# EAGLE design motordriver (EAGLE 7.2.0)
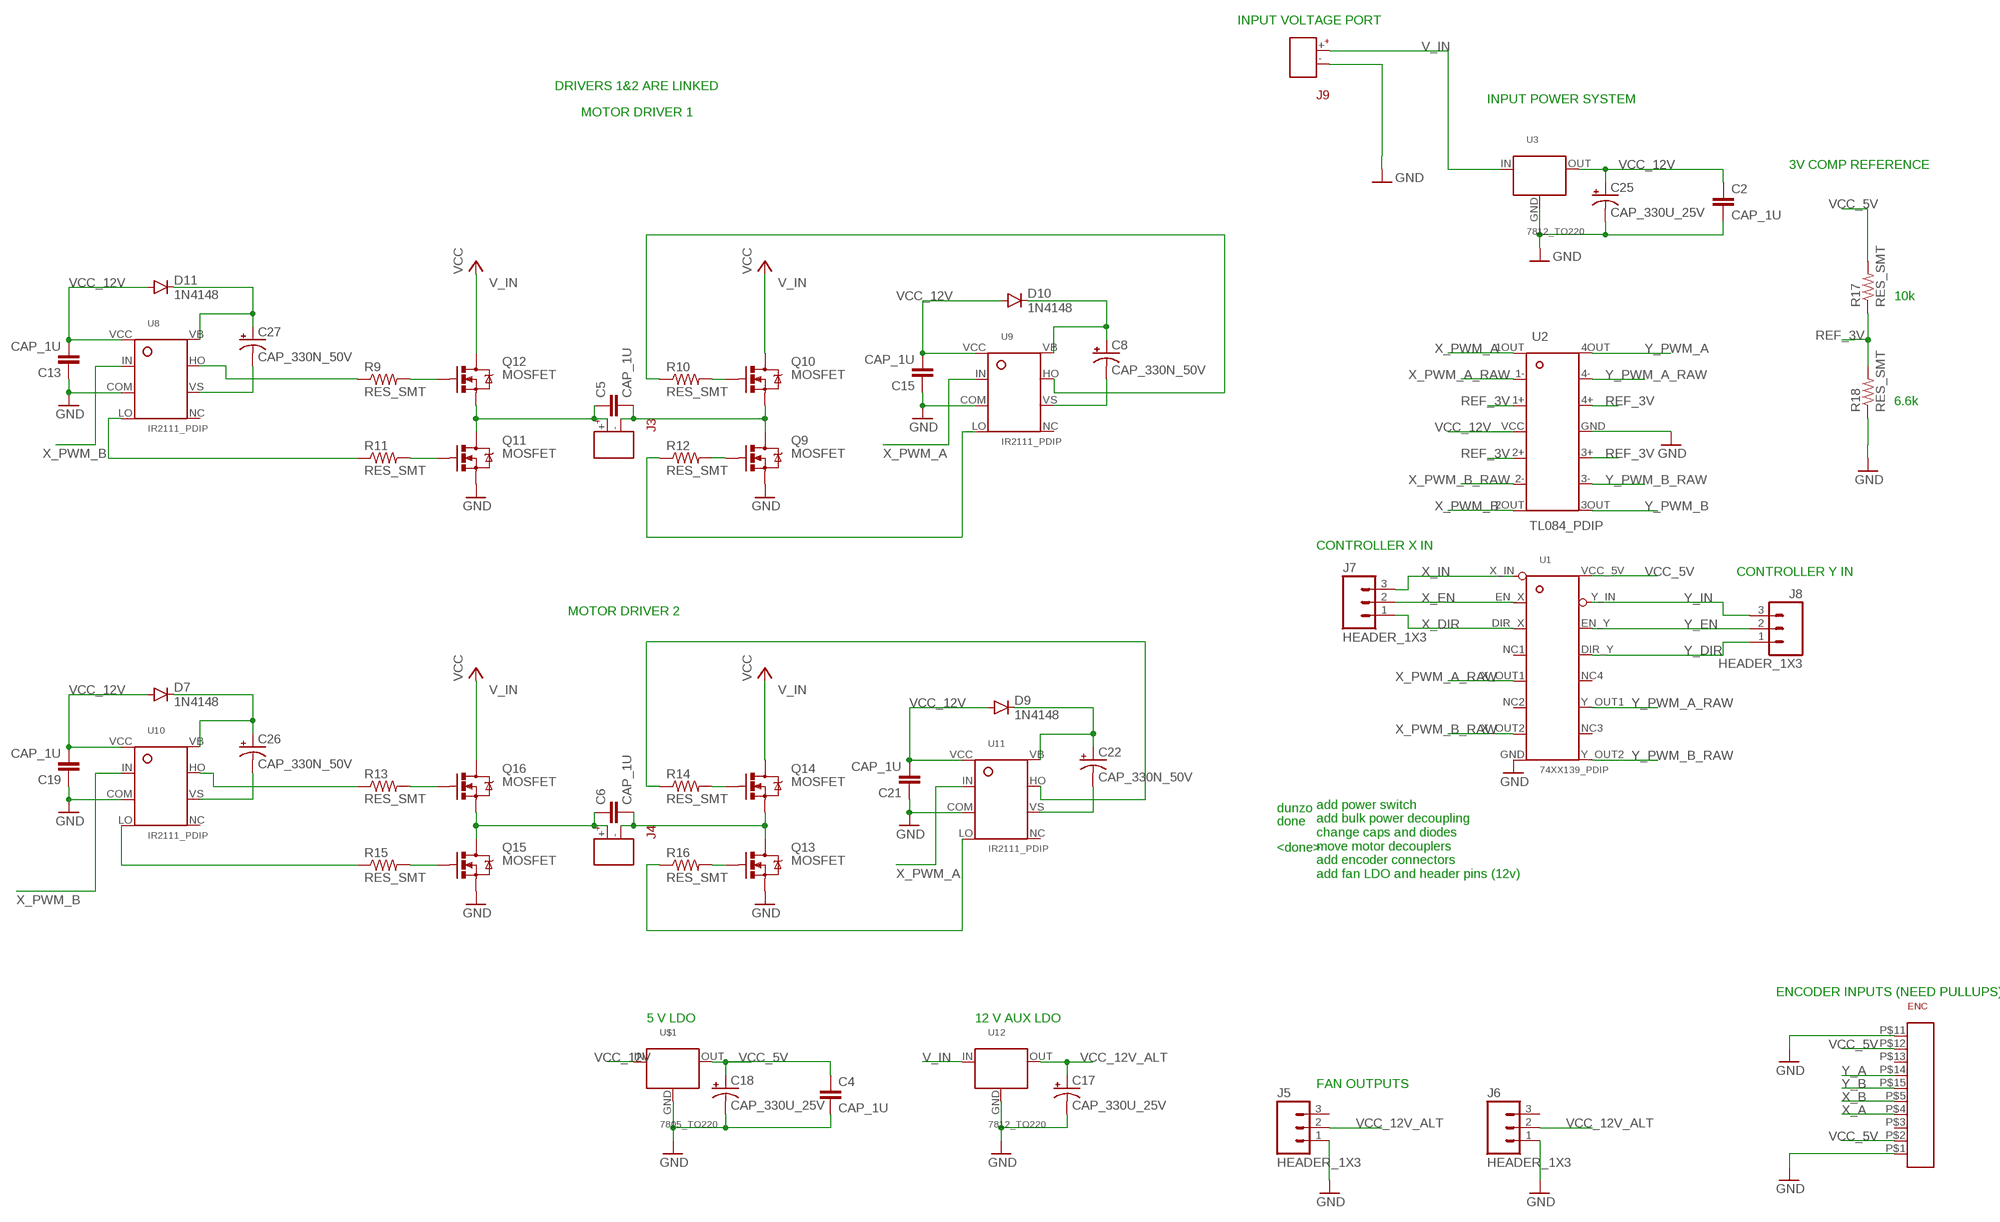
[diagram p0: schematic, sheet 1, part 1 of 2]
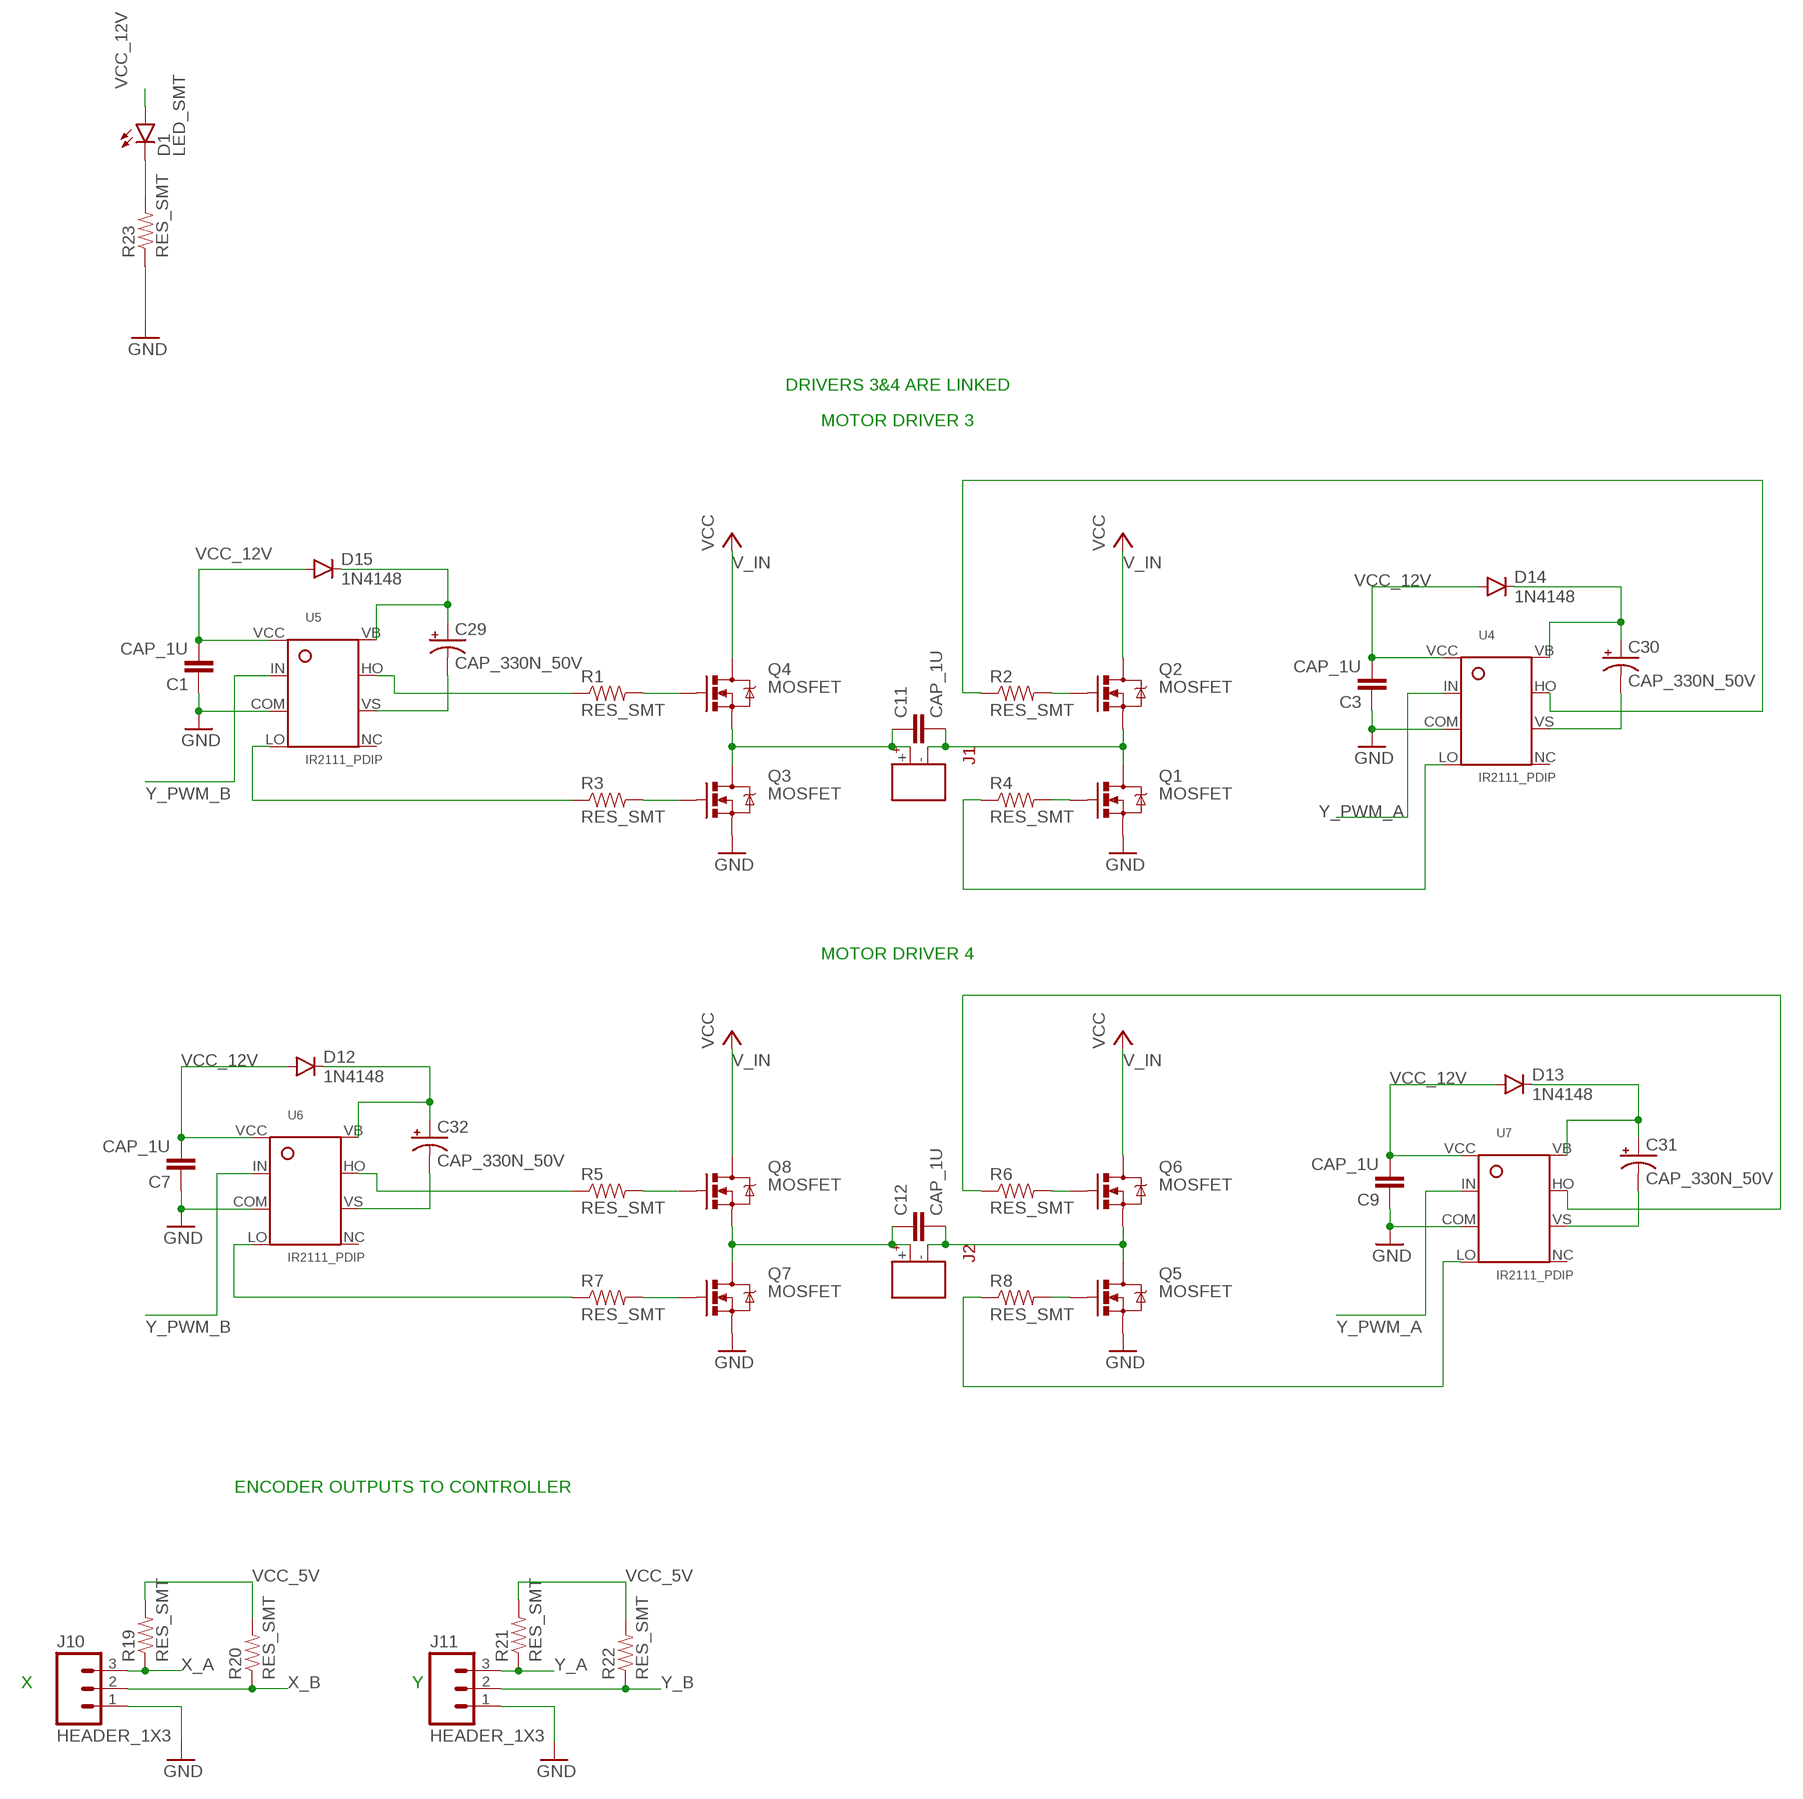
[diagram p1: schematic, sheet 1, part 2 of 2]

## Parts
C1  CAP_1U  [2DIP]
C2  CAP_1U  [2DIP]
C3  CAP_1U  [2DIP]
C4  CAP_1U  [2DIP]
C5  CAP_1U  [2DIP]
C6  CAP_1U  [2DIP]
C7  CAP_1U  [2DIP]
C8  CAP_330N_50V  [RADIAL_5]
C9  CAP_1U  [2DIP]
C11  CAP_1U  [2DIP]
C12  CAP_1U  [2DIP]
C13  CAP_1U  [2DIP]
C15  CAP_1U  [2DIP]
C17  CAP_330U_25V  [RADIAL_1O]
C18  CAP_330U_25V  [RADIAL_1O]
C19  CAP_1U  [2DIP]
C21  CAP_1U  [2DIP]
C22  CAP_330N_50V  [RADIAL_5]
C25  CAP_330U_25V  [RADIAL_1O]
C26  CAP_330N_50V  [RADIAL_5]
C27  CAP_330N_50V  [RADIAL_5]
C29  CAP_330N_50V  [RADIAL_5]
C30  CAP_330N_50V  [RADIAL_5]
C31  CAP_330N_50V  [RADIAL_5]
C32  CAP_330N_50V  [RADIAL_5]
D1  LED_SMT  [LED_0603]
D7  1N4148  [1N4148]
D9  1N4148  [1N4148]
D10  1N4148  [1N4148]
D11  1N4148  [1N4148]
D12  1N4148  [1N4148]
D13  1N4148  [1N4148]
D14  1N4148  [1N4148]
D15  1N4148  [1N4148]
ENC  CONN_5X2  [CONN_5X2]
J1  CONNECTOR_MOTORS  [CONN_MOTOR]
J2  CONNECTOR_MOTORS  [CONN_MOTOR]
J3  CONNECTOR_MOTORS  [CONN_MOTOR]
J4  CONNECTOR_MOTORS  [CONN_MOTOR]
J5  HEADER_1X3  [HEADER_1X3]
J6  HEADER_1X3  [HEADER_1X3]
J7  HEADER_1X3  [HEADER_1X3]
J8  HEADER_1X3  [HEADER_1X3]
J9  CONNECTOR_MOTORS  [CONN_MOTOR]
J10  HEADER_1X3  [HEADER_1X3]
J11  HEADER_1X3  [HEADER_1X3]
Q1  MOSFET  [MOSFET]
Q2  MOSFET  [MOSFET]
Q3  MOSFET  [MOSFET]
Q4  MOSFET  [MOSFET]
Q5  MOSFET  [MOSFET]
Q6  MOSFET  [MOSFET]
Q7  MOSFET  [MOSFET]
Q8  MOSFET  [MOSFET]
Q9  MOSFET  [MOSFET]
Q10  MOSFET  [MOSFET]
Q11  MOSFET  [MOSFET]
Q12  MOSFET  [MOSFET]
Q13  MOSFET  [MOSFET]
Q14  MOSFET  [MOSFET]
Q15  MOSFET  [MOSFET]
Q16  MOSFET  [MOSFET]
R1  RES_SMT  [0603]
R2  RES_SMT  [0603]
R3  RES_SMT  [0603]
R4  RES_SMT  [0603]
R5  RES_SMT  [0603]
R6  RES_SMT  [0603]
R7  RES_SMT  [0603]
R8  RES_SMT  [0603]
R9  RES_SMT  [0603]
R10  RES_SMT  [0603]
R11  RES_SMT  [0603]
R12  RES_SMT  [0603]
R13  RES_SMT  [0603]
R14  RES_SMT  [0603]
R15  RES_SMT  [0603]
R16  RES_SMT  [0603]
R17  RES_SMT  [0603]
R18  RES_SMT  [0603]
R19  RES_SMT  [0603]
R20  RES_SMT  [0603]
R21  RES_SMT  [0603]
R22  RES_SMT  [0603]
R23  RES_SMT  [0603]
U1  74XX139_PDIP  [16PDIP]
U2  TL084_PDIP  [14PDIP]
U3  7812_TO220  [TO-220]
U4  IR2111_PDIP  [8PDIP]
U5  IR2111_PDIP  [8PDIP]
U6  IR2111_PDIP  [8PDIP]
U7  IR2111_PDIP  [8PDIP]
U8  IR2111_PDIP  [8PDIP]
U9  IR2111_PDIP  [8PDIP]
U10  IR2111_PDIP  [8PDIP]
U11  IR2111_PDIP  [8PDIP]
U12  7812_TO220  [TO-220]
U$1  7805_TO220  [TO-220]

## Nets
GND_32: C1.P$1 C2.P$2 C3.P$1 C4.P$2 C7.P$1 C9.P$1 C13.P$1 C15.P$1 C17.- C18.- C19.P$1 C21.P$1 C25.- ENC.P$1 ENC.P$11 J5.1 J6.1 J9.- J10.1 J11.1 Q1.S Q3.S Q5.S Q7.S Q9.S Q11.S Q13.S Q15.S R18.1 R23.1 U1.GND U2.GND U3.GND U4.COM U5.COM U6.COM U7.COM U8.COM U9.COM U10.COM U11.COM U12.GND U$1.GND ; supply symbol labelled GND
N$1: R12.1 U9.LO
N$2: R8.1 U7.LO
N$3: R10.1 U9.HO
N$4: D1.C R23.2
N$9: R15.1 U10.LO
N$13: C29.+ D15.C U5.VB
N$14: Q1.G R4.2
N$15: C29.- U5.VS
N$16: R1.1 U5.HO
N$17: Q4.G R1.2
N$18: C11.P$1 J1.+ Q3.D Q4.S
N$19: R4.1 U4.LO
N$20: R3.1 U5.LO
N$21: C11.P$2 J1.- Q1.D Q2.S
N$22: Q3.G R3.2
N$24: Q2.G R2.2
N$25: C30.+ D14.C U4.VB
N$26: C30.- U4.VS
N$27: R2.1 U4.HO
N$28: R9.1 U8.HO
N$29: R11.1 U8.LO
N$30: C32.+ D12.C U6.VB
N$31: C32.- U6.VS
N$32: R5.1 U6.HO
N$33: Q8.G R5.2
N$34: C12.P$1 J2.+ Q7.D Q8.S
N$36: Q5.G R8.2
N$37: C12.P$2 J2.- Q5.D Q6.S
N$38: C31.+ D13.C U7.VB
N$39: C31.- U7.VS
N$40: R6.1 U7.HO
N$41: R7.1 U6.LO
N$42: Q7.G R7.2
N$43: Q6.G R6.2
N$45: R16.1 U11.LO
N$46: Q13.G R16.2
N$47: C27.+ D11.C U8.VB
N$48: C27.- U8.VS
N$49: Q9.G R12.2
N$50: Q12.G R9.2
N$51: C5.P$1 J3.+ Q11.D Q12.S
N$54: C5.P$2 J3.- Q9.D Q10.S
N$55: C8.+ D10.C U9.VB
N$56: C8.- U9.VS
N$59: Q11.G R11.2
N$60: Q10.G R10.2
N$64: C26.+ D7.C U10.VB
N$65: C26.- U10.VS
N$66: R13.1 U10.HO
N$67: Q16.G R13.2
N$68: C6.P$1 J4.+ Q15.D Q16.S
N$71: C6.P$2 J4.- Q13.D Q14.S
N$72: C22.+ D9.C U11.VB
N$73: C22.- U11.VS
N$74: R14.1 U11.HO
N$76: Q15.G R15.2
N$77: Q14.G R14.2
REF_3V: R17.1 R18.2 U2.1+ U2.2+ U2.3+ U2.4+
V_IN: J9.+ Q2.D Q4.D Q6.D Q8.D Q10.D Q12.D Q14.D Q16.D U3.IN U12.IN ; supply symbol labelled VCC
VCC_5V: C4.P$1 C18.+ ENC.P$2 ENC.P$12 R17.2 R19.2 R20.2 R21.2 R22.2 U1.VCC_5V U$1.OUT
VCC_12V: C1.P$2 C2.P$1 C3.P$2 C7.P$2 C9.P$2 C13.P$2 C15.P$2 C19.P$2 C21.P$2 C25.+ D1.A D7.A D9.A D10.A D11.A D12.A D13.A D14.A D15.A U2.VCC U3.OUT U4.VCC U5.VCC U6.VCC U7.VCC U8.VCC U9.VCC U10.VCC U11.VCC U$1.IN
VCC_12V_ALT: C17.+ J5.2 J6.2 U12.OUT
X_A: ENC.P$4 J10.3 R19.1
X_B: ENC.P$5 J10.2 R20.1
X_DIR: J7.1 U1.DIR_X
X_EN: J7.2 U1.EN_X
X_IN: J7.3 U1.X_IN
X_PWM_A: U2.1OUT(OUT1) U9.IN U11.IN
X_PWM_A_RAW: U1.X_OUT1 U2.1-
X_PWM_B: U2.2OUT(OUT2) U8.IN U10.IN
X_PWM_B_RAW: U1.X_OUT2 U2.2-
Y_A: ENC.P$14 J11.3 R21.1
Y_B: ENC.P$15 J11.2 R22.1
Y_DIR: J8.1 U1.DIR_Y
Y_EN: J8.2 U1.EN_Y
Y_IN: J8.3 U1.Y_IN
Y_PWM_A: U2.4OUT(OUT4) U4.IN U7.IN
Y_PWM_A_RAW: U1.Y_OUT1 U2.4-
Y_PWM_B: U2.3OUT(OUT3) U5.IN U6.IN
Y_PWM_B_RAW: U1.Y_OUT2 U2.3-
Unconnected: ENC.P$3 ENC.P$13 J5.3 J6.3 U1.NC1 U1.NC2 U1.NC3 U1.NC4 U4.NC U5.NC U6.NC U7.NC U8.NC U9.NC U10.NC U11.NC

## Notes on the sheet
- INPUT VOLTAGE PORT
- DRIVERS 1&2 ARE LINKED
- INPUT POWER SYSTEM
- MOTOR DRIVER 1
- 3V COMP REFERENCE
- DRIVERS 3&4 ARE LINKED
- MOTOR DRIVER 3
- 10k
- 6.6k
- CONTROLLER X IN
- CONTROLLER Y IN
- MOTOR DRIVER 4
- MOTOR DRIVER 2
- dunzo
- done
- <done>
- add power switch
  add bulk power decoupling
  change caps and diodes
  move motor decouplers 
  add encoder connectors
  add fan LDO and header pins (12v)
- ENCODER INPUTS (NEED PULLUPS) | ENCODER OUTPUTS TO CONTROLLER
- 5 V LDO | 12 V AUX LDO
- FAN OUTPUTS
- X | Y

## Library data of the parts
C1-C7 C9 C11-C13 C15 C19 C21 = motordriverslib:CAP_1U
C8 C22 C26 C27 C29-C32 = motordriverslib:CAP_330N_50V
C17 C18 C25 = motordriverslib:CAP_330U_25V
D1 = motordriverslib:LED_SMT
D7 D9-D15 = motordriverslib:1N4148
ENC = motordriverslib:CONN_5X2
J1-J4 J9 = motordriverslib:CONNECTOR_MOTORS
J5-J8 J10 J11 = motordriverslib:HEADER_1X3
Q1-Q16 = motordriverslib:MOSFET
R1-R23 = motordriverslib:RES_SMT
U1 = motordriverslib:74XX139_PDIP
U2 = motordriverslib:TL084_PDIP
U3 U12 = motordriverslib:7812_TO220
U4-U11 = motordriverslib:IR2111_PDIP
U$1 = motordriverslib:7805_TO220

## Board
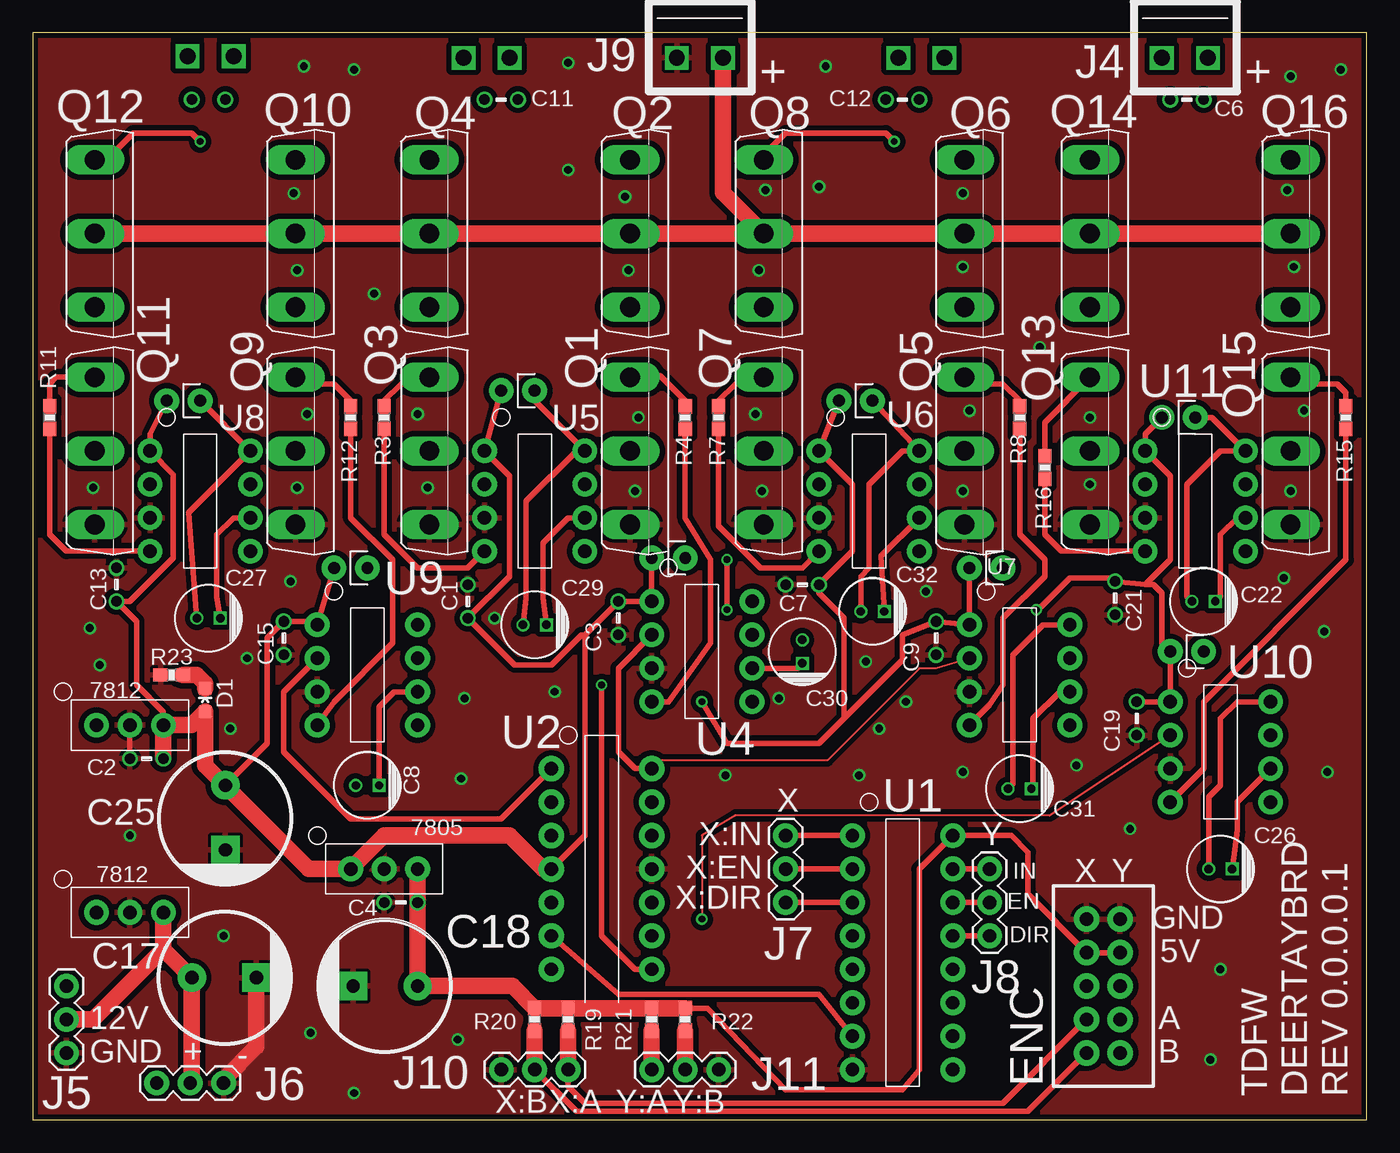
[diagram p2: board, top side]
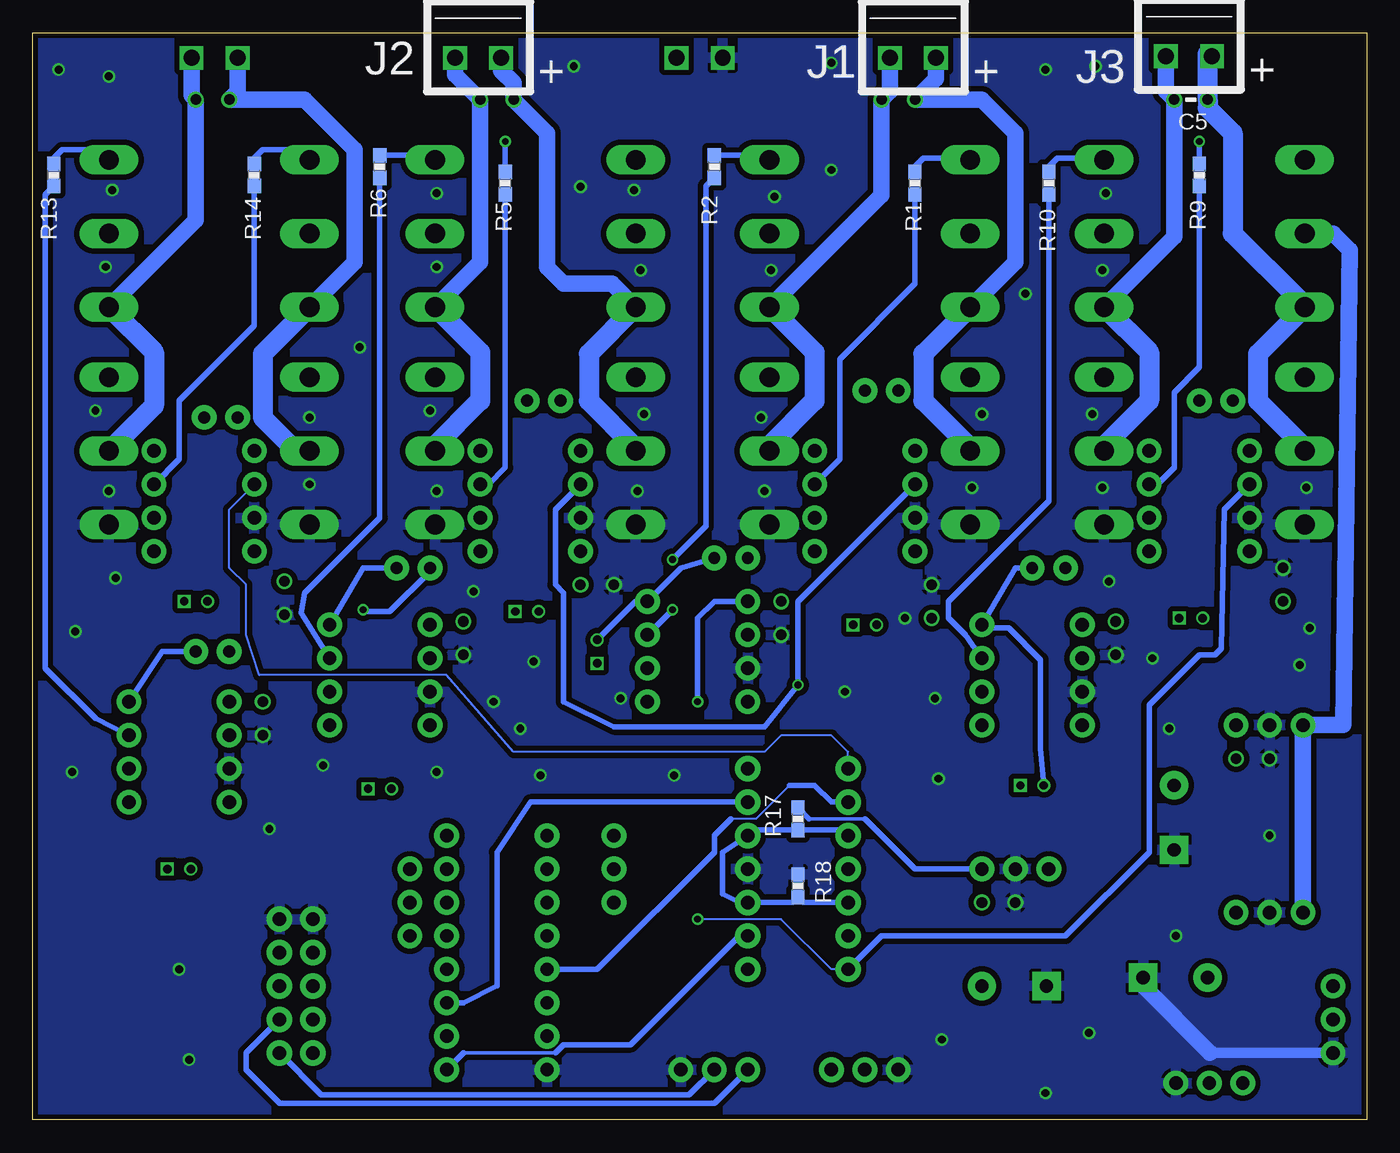
[diagram p3: board, bottom side, seen from below]

Size 101.27 x 82.54 mm. Coordinates in mm from the lower left corner, seen from the top.
Outline: 0,0 101.27,0 101.27,82.54 0,82.54 0,0
Copper layers (1*16): Top 0.0356mm / dielectric 1.5011mm / Bottom 0.0356mm
Design rules "OSHPark": minimum track width 6mil, minimum drill 13mil, track to track 6mil, track to pad 6mil, pad to pad 6mil, via to via 6mil, smd to smd 6mil, copper to edge 15mil, drill to drill 6mil, minimum pad ring 7mil, minimum via ring 7mil, stop-mask expansion 3mil, vias tented up to drill 0mil, thermal gap 10mil

### Footprints (pad centres in the part's own frame; a part is rotated, then mirrored left to right if it is on the bottom)
2DIP = drill 0.8: P$1 0,0; P$2 0,2.54
RADIAL_5 = drill 0.635: + -0.889,0 | drill 0.635 square: - 0.889,0
RADIAL_1O = drill 1.016 pad 2.159: + 0,0 | drill 1.016 pad 2.159 square: - 4.9,0
LED_0603 = smd 1 x 1: A 0,-0.877; C 0,0.877
1N4148 = drill 0.9 pad 1.88: A 0,0; C 0,-2.54
CONN_5X2 = drill 1.016 pad 1.93: P$1 -5.08,-1.27; P$2 -2.54,-1.27; P$3 0,-1.27; P$4 2.54,-1.27; P$5 5.08,-1.27; P$11 -5.08,1.27; P$12 -2.54,1.27; P$13 0,1.27; P$14 2.54,1.27; P$15 5.08,1.27
CONN_MOTOR = drill 1.2 square: + 0,1.595; - 0,-1.905
HEADER_1X3 = drill 1.016 pad 1.88: 1 -2.54,0; 2 0,0; 3 2.54,0
MOSFET = drill 1.499 long: D 0,0.889; G -5.588,0.889; S 5.588,0.889
0603 = smd 1.1 x 1: 1 -0.85,0; 2 0.85,0
16PDIP = drill 1.016 pad 1.88: DIR_X 0,-5.08; DIR_Y 7.62,-7.62; EN_X 0,-2.54; EN_Y 7.62,-5.08; GND 0,-17.78; NC1 0,-7.62; NC2 0,-12.7; NC3 7.62,-15.24; NC4 7.62,-10.16; VCC_5V 7.62,0; X_IN 0,0; X_OUT1 0,-10.16; X_OUT2 0,-15.24; Y_IN 7.62,-2.54; Y_OUT1 7.62,-12.7; Y_OUT2 7.62,-17.78
14PDIP = drill 1.016 pad 1.93: 1+ 0,-5.08; 1- 0,-2.54; 1OUT 0,0; 2+ 0,-10.16; 2- 0,-12.7; 2OUT 0,-15.24; 3+ 7.62,-10.16; 3- 7.62,-12.7; 3OUT 7.62,-15.24; 4+ 7.62,-5.08; 4- 7.62,-2.54; 4OUT 7.62,0; GND 7.62,-7.62; VCC 0,-7.62
TO-220 = drill 1.016 pad 1.88: GND 0,0; IN -2.54,0; OUT 2.54,0
8PDIP = drill 1.016 pad 1.88: COM 0,-5.08; HO 7.62,-2.54; IN 0,-2.54; LO 0,-7.62; NC 7.62,-7.62; VB 7.62,0; VCC 0,0; VS 7.62,-5.08

### Placement (x,y rotation side)
C1  33.02,40.64 180 top
C2  9.91,27.43 90 top
C3  44.45,36.83 0 top
C4  29.21,16.51 90 top
C5  12.06,77.47 90 bottom
C6  88.9,77.47 90 top
C7  57.15,40.64 270 top
C8  25.4,25.4 0 top
C9  68.58,35.31 0 top
C11  34.29,77.47 270 top
C12  64.77,77.47 270 top
C13  6.35,41.91 180 top
C15  19.05,35.31 0 top
C17  12.06,10.79 0 top
C18  29.21,10.16 180 top
C19  83.82,29.21 0 top
C21  82.17,38.35 0 top
C22  88.9,39.37 0 top
C25  14.61,25.4 270 top
C26  90.17,19.05 0 top
C27  13.34,38.1 0 top
C29  38.1,37.59 0 top
C30  58.42,35.56 270 top
C31  74.93,25.15 0 top
C32  63.75,38.61 0 top
D1  13.08,31.88 0 top
D7  86.36,35.56 90 top
D9  85.72,53.34 90 top
D10  22.86,41.91 90 top
D11  10.16,54.61 90 top
D12  61.21,54.61 90 top
D13  71.12,41.91 90 top
D14  46.99,42.67 90 top
D15  35.56,55.37 90 top
ENC  81.28,10.16 270 top
J1  34.29,80.64 270 bottom
J2  67.31,80.64 270 bottom
J3  13.34,80.77 270 bottom
J4  87.63,80.64 270 top
J5  2.54,7.62 90 top
J6  11.94,2.79 180 top
J7  57.15,19.05 90 top
J8  72.64,16.51 90 top
J9  50.8,80.64 270 top
J10  38.1,3.81 0 top
J11  49.53,3.81 180 top
Q1  44.45,50.8 270 top
Q2  44.45,67.31 270 top
Q3  29.21,50.8 270 top
Q4  29.21,67.31 270 top
Q5  69.85,50.8 270 top
Q6  69.85,67.31 270 top
Q7  54.61,50.8 270 top
Q8  54.61,67.31 270 top
Q9  19.05,50.8 270 top
Q10  19.05,67.31 270 top
Q11  3.81,50.8 270 top
Q12  3.81,67.31 270 top
Q13  79.38,50.8 270 top
Q14  79.38,67.31 270 top
Q15  94.61,50.8 270 top
Q16  94.61,67.31 270 top
R1  34.29,71.12 90 bottom
R2  49.53,72.39 90 bottom
R3  26.67,53.34 90 top
R4  49.53,53.34 90 top
R5  65.41,71.12 90 bottom
R6  74.93,72.39 90 bottom
R7  52.07,53.34 90 top
R8  74.93,53.34 90 top
R9  12.7,71.75 90 bottom
R10  24.13,71.12 90 bottom
R11  1.27,53.34 90 top
R12  24.13,53.34 90 top
R13  99.69,71.75 90 bottom
R14  84.45,71.75 90 bottom
R15  99.69,53.34 90 top
R16  76.83,49.53 90 top
R17  43.18,22.86 90 bottom
R18  43.18,17.78 270 bottom
R19  40.64,7.62 90 top
R20  38.1,7.62 90 top
R21  46.99,7.62 90 top
R22  49.53,7.62 90 top
R23  10.54,33.78 0 top
U1  62.23,21.59 0 top
U2  39.37,26.67 0 top
U3  7.37,29.97 0 top
U4  46.99,39.37 0 top
U5  34.29,50.8 0 top
U6  59.69,50.8 0 top
U7  71.12,37.59 0 top
U8  8.89,50.8 0 top
U9  21.59,37.59 0 top
U10  86.36,31.75 0 top
U11  84.45,50.8 0 top
U12  7.37,15.75 0 top
U$1  26.67,19.05 0 top

### Tracks (layer width: path | path; a pad name or v marks a point on that pad's centre or on a via)
GND_32  (via drill 0.6)
  Top 0.406: C2.P$2 U3.GND
  Top 1.27: C17.- 16.96,5.54 14.48,3.05 J6.1
  Bottom 0.813: J5.1 11.88,5.08
  Bottom 1.27: 11.88,5.08 16.96,10.16 C17.-
  other vias: 5.08,34.54 14.99,29.72 16.26,35.05 7.37,21.59 66.29,31.75 64.26,29.72 67.82,40.13 24.38,2.03 21.08,6.6 14.48,13.97 32.51,25.91 32.77,32 52.58,26.16 62.74,26.16 70.61,26.42 83.31,22.1 90.17,11.43 89.41,4.57 98.3,26.42 98.04,37.08 40.64,72.14 24.38,79.76 20.57,80.01 60.2,80.01 59.69,70.87 40.64,80.26 99.31,79.76 95.5,79.25 95,41.15 79.25,26.92 32.26,6.1 56.64,32 63.25,34.8 35.05,38.1 19.56,40.89 4.32,37.34 4.57,48.01 20.07,48.01 29.97,48.01 20.83,53.59 29.21,53.59 20.07,64.52 19.81,70.36 25.91,62.74 45.21,64.52 44.96,70.1 55.12,64.52 55.63,70.61 54.86,53.59 45.97,53.34 45.72,47.75 55.37,47.75 70.61,47.75 71.12,53.85 70.61,64.77 70.61,70.36 76.45,58.67 80.26,53.34 80.26,48.26 95.5,47.75 96.52,53.85 95.76,64.77 95.25,70.61 39.62,32.51
  pour Bottom (isolate 0.406): 0,82.55 0,0 101.6,0 101.6,82.55
  pour Top (isolate 0.406): 0,82.55 0,0 101.6,0 101.6,82.55
N$1
  Top 0.406: U9.LO 22.86,31.75 27.3,36.2 27.3,42.55 24.13,45.72 R12.1
N$2
  Top 0.406: U7.LO 72.64,31.5 73.66,33.02 73.66,38.1 76.83,41.27 76.83,42.55 74.93,44.45 R8.1
N$3
  Bottom 0.406: U9.HO 30.48,36.83 31.75,38.1 31.75,39.37 24.13,46.99 R10.1
N$4
  Top 1.27: D1.C 13.08,33.15 12.45,33.78 R23.2
N$9
  Top 0.406: U10.LO 88.9,26.67 88.9,31.75 99.69,42.55 R15.1
N$13
  Top 0.406: C29.+ 37.47,39.62 37.47,46.99 41.27,50.8 U5.VB 38.1,54.61 D15.C
N$14
  Top 0.406: R4.2 49.53,54.61 47.62,56.52 45.47,56.52 Q1.G
N$15
  Top 0.406: U5.VS 40.64,45.72 38.73,43.81 38.73,39.62 C29.-
N$16
  Bottom 0.406: U5.HO 40.01,50.16 40.01,57.78 34.29,63.5 R1.1
N$17
  Bottom 0.406: R1.2 34.29,72.39 33.66,73.03 30.23,73.03 Q4.G
N$18
  Bottom 1.27: J1.+ 32.7,79.06 C11.P$1 29.21,77.47 26.67,74.93 26.67,65.15 Q4.S
  Bottom 1.524: Q4.S 33.66,58.17 33.66,54.61 30.1,51.05 Q3.D
N$19
  Top 0.406: U4.LO 48.26,31.75 51.44,36.2 51.44,42.55 49.53,45.72 R4.1
N$20
  Top 0.406: U5.LO 33.02,41.91 29.21,41.91 26.67,44.45 R3.1
N$21
  Bottom 1.27: J1.- 36.2,78.11 C11.P$2 36.83,70.23 Q2.S
  Bottom 1.524: Q2.S 41.91,58.29 41.91,54.61 45.34,51.18 Q1.D
N$22
  Top 0.406: R3.2 26.67,54.61 27.94,55.88 29.59,55.88 Q3.G
N$24
  Bottom 0.406: R2.2 45.68,73.24 Q2.G
N$25
  Bottom 0.406: D14.C 52.07,41.91 U4.VB 55.5,39.37 C30.+
N$26
  Top 0.406: U4.VS 58.04,34.29 C30.-
N$27  (via drill 0.51)
  Top 0.406: v52.7,42.55 v52.7,38.73
  Bottom 0.406: U4.HO v52.7,38.73 | v52.7,42.55 50.16,45.09 50.16,70.91 R2.1
N$28
  Bottom 0.406: R9.1 12.7,57.15 14.61,55.24 14.61,49.53 15.88,48.26 U8.HO
N$29
  Top 0.406: U8.LO 2.54,43.18 1.27,44.45 R11.1
N$30
  Top 0.406: D12.C U6.VB 66.04,50.8 63.5,48.26 63.5,41.91 62.87,41.27 C32.+
N$31
  Top 0.406: C32.- 64.39,42.8 U6.VS
N$32
  Bottom 0.406: U6.HO 66.67,48.26 65.41,49.53 R5.1
N$33  (via drill 0.51)
  Top 0.406: Q8.G 55.5,73.28 57.15,74.93 64.77,74.93 v65.41,74.3
  Bottom 0.406: v65.41,74.3 R5.2
N$34
  Bottom 1.27: J2.+ 65.72,79.69 64.77,78.74 C12.P$1 62.23,74.93 62.23,64.77 60.96,63.5 57.28,63.5 Q8.S
  Bottom 1.524: Q8.S 59.05,58.17 59.05,54.61 55.5,51.05 Q7.D
N$36
  Top 0.406: R8.2 74.93,54.61 73.66,55.88 71.25,55.88 Q5.G
N$37
  Bottom 1.27: J2.- 69.22,79.38 C12.P$2 67.31,65.15 Q6.S
  Bottom 1.524: Q6.S 67.31,58.29 67.31,54.61 70.74,51.18 Q5.D
N$38
  Top 0.406: U7.VB 76.71,37.59 74.42,35.31 74.42,25.53 C31.+
  Bottom 0.406: D13.C 76.2,41.91 U7.VB
N$39
  Top 0.406: U7.VS 77.98,32.51 75.95,30.48 75.95,25.27 C31.-
N$40
  Bottom 0.406: U7.HO 80.9,38.48 80.64,40.01 74.93,45.72 R6.1
N$41
  Top 0.406: U6.LO 58.42,41.91 55.24,41.91 52.07,45.09 R7.1
N$42
  Top 0.406: R7.2 52.07,54.61 53.34,55.88 54.99,55.88 Q7.G
N$43
  Bottom 0.406: R6.2 71.08,73.24 Q6.G
N$45
  Top 0.406: R16.1 76.83,44.45 78.11,43.18 U11.LO
N$46
  Top 0.406: R16.2 76.83,52.96 Q13.G
N$47
  Top 0.406: D11.C U8.VB 11.81,46.1 C27.+
N$48
  Top 0.406: C27.- 13.97,39.75 13.97,44.45 15.24,45.72 U8.VS
N$49
  Top 0.406: R12.2 24.13,54.61 22.86,55.88 20.45,55.88 Q9.G
N$50  (via drill 0.51)
  Top 0.406: v12.7,74.3 12.06,74.93 7.62,74.93 5.59,72.9 Q12.G
  Bottom 0.406: R9.2 v12.7,74.3
N$51
  Bottom 1.524: Q11.D 4.7,51.05 8.26,54.61 8.26,58.17 Q12.S 5.08,62.1 5.08,62.23 10.16,67.31 10.16,74.93 12.06,76.83 C5.P$1 12.06,80.95 J3.+
N$54
  Bottom 1.27: J3.- 15.24,78.11 C5.P$2 14.61,67.06 Q10.S
  Bottom 1.524: Q10.S 16.51,58.29 16.51,54.61 19.94,51.18 Q9.D
N$55
  Bottom 0.406: C8.+ 24.77,28.19 24.77,34.92 27.18,37.34 28.96,37.34 U9.VB 26.67,41.91 D10.C
N$56
  Top 0.406: C8.- 26.29,31.37 27.43,32.51 U9.VS
N$59
  Top 0.406: Q11.G 1.78,56.39 1.27,55.88 R11.2
N$60
  Bottom 0.406: R10.2 24.13,72.39 23.5,73.03 20.07,73.03 Q10.G
N$64
  Top 0.406: C26.+ 89.28,24.51 90.17,25.4 90.17,30.48 91.44,31.75 U10.VB
  Bottom 0.406: D7.C 91.44,35.56 U10.VB
N$65
  Top 0.406: C26.- 91.44,21.97 91.44,24.13 U10.VS
N$66
  Bottom 0.406: U10.HO 96.52,30.48 100.33,34.29 100.33,70.27 R13.1
N$67
  Bottom 0.406: R13.2 99.69,73.03 99.06,73.66 96.27,73.66 Q16.G
N$68
  Bottom 1.27: J4.+ 89.22,77.8 C6.P$1 88.9,68.33 Q16.S
  Bottom 1.524: Q16.S 92.08,58.29 92.08,54.23 Q15.D
N$71
  Bottom 1.27: J4.- 85.72,78.11 C6.P$2 80.64,77.47 76.83,73.66 76.83,65.15 Q14.S
  Bottom 1.524: Q14.S 83.82,58.17 83.82,53.34 81.28,50.8 Q13.D
N$72
  Top 0.406: D9.C 89.53,53.34 U11.VB 90.17,50.8 87.63,48.26 87.63,39.75 C22.+
N$73
  Top 0.406: U11.VS 91.44,45.72 90.17,44.45 90.17,39.75 C22.-
N$74
  Bottom 0.406: R14.1 84.45,60.33 90.17,54.61 90.17,50.16 U11.HO
N$76
  Top 0.406: R15.2 99.69,55.24 99.06,55.88 96.01,55.88 Q15.G
N$77
  Bottom 0.406: R14.2 84.45,73.03 83.82,73.66 81.03,73.66 Q14.G
REF_3V
  Bottom 0.406: U2.1+ 39.79,22.01 R17.1 46.57,22.01 U2.4+ 48.9,20.32 48.9,17.14 47.62,16.51 U2.3+ 43.6,16.51 R18.2 42.76,16.51 U2.2+
V_IN
  Top 1.27: J9.+ 52.4,70.41 Q8.D | Q8.D Q6.D Q14.D Q16.D | Q8.D Q2.D Q4.D Q10.D Q12.D
  Bottom 1.27: Q12.D 2.54,67.31 1.27,66.04 1.78,29.97 U3.IN U12.IN
VCC_5V
  Top 0.406: ENC.P$12 ENC.P$2 75.56,17.14 75.56,20.32 74.3,21.59 U1.VCC_5V 67.31,19.05 67.31,3.81 66.04,2.29 57.15,2.29 51.22,8.47 R22.2
  Top 1.27: U$1.OUT C4.P$1 C18.+ 36.41,10.16 R20.2 R19.2 R21.2 R22.2
  Bottom 0.254: 42.33,22.86 38.1,22.86
  Bottom 0.406: R17.2 42.33,22.86 | 38.1,22.86 34.29,19.05 U$1.OUT
VCC_12V  (via drill 0.51)
  Top 0.406: D11.A 8.89,52.07 U8.VCC 10.67,49.02 10.67,42.67 7.37,39.37 C13.P$2 7.87,37.85 7.87,33.02 9.91,30.99 U3.OUT | D10.A U9.VCC 21.34,37.85 C15.P$2 17.78,36.58 17.78,28.57 C25.+ | 41.91,36.83 C3.P$2 U4.VCC D14.A | 41.91,36.83 41.91,21.59 U2.VCC | D15.A U5.VCC 36.2,48.9 36.2,41.27 C1.P$2 36.58,34.54 39.37,34.54 41.66,36.83 41.91,36.83 | D12.A U6.VCC 62.23,48.26 62.23,43.18 C7.P$2 59.69,40.01 61.59,38.1 61.59,30.48 | 61.59,30.48 59.69,28.57 52.7,28.57 v50.8,31.75 | D13.A U7.VCC C9.P$2 66.04,36.83 66.04,34.92 61.59,30.48 | 84.45,40.64 C21.P$2 81.92,41.15 78.74,41.15 76.33,38.73 v76.2,38.73 | 84.45,40.64 86.36,42.55 86.36,48.9 U11.VCC 84.45,52.07 D9.A | 84.45,40.64 85.09,40.64 85.72,40.01 85.72,36.2 D7.A U10.VCC C19.P$2
  Top 1.27: C2.P$1 U3.OUT 12.05,29.97 D1.A 13.08,26.92 C25.+ | C25.+ 14.36,25.4 | U2.VCC 38.73,19.05 36.2,21.59 26.67,21.59 U$1.IN 20.95,19.05 C25.+
  Bottom 0.406: v50.8,31.75 50.8,38.1 49.53,39.37 U4.VCC | D13.A 71.12,41.66 74.17,38.61 76.07,38.61 v76.2,38.73
VCC_12V_ALT
  Top 1.27: J6.2 12.06,2.92 C17.+ 9.91,12.95 | U12.OUT 9.91,12.95 | J5.2 4.57,7.62 9.91,12.95
X_A
  Top 0.406: ENC.P$4 73.66,1.27 41.91,1.27 40.64,2.54 J10.3
  Top 1.27: R19.1 J10.3
X_B
  Top 0.406: J10.2 41.27,0.64 75.56,0.64 ENC.P$5
  Top 1.27: R20.1 J10.2
X_DIR
  Top 0.406: U1.DIR_X J7.1
X_EN
  Top 0.406: U1.EN_X J7.2
X_IN
  Top 0.406: J7.3 U1.X_IN
X_PWM_A
  Top 0.406: U2.1OUT 35.56,22.86 24.13,22.86 19.05,27.94 19.05,32.51 U9.IN
  Bottom 0.152: U2.1OUT 39.37,27.94 40.64,29.21 44.45,29.21 45.72,27.94 64.77,27.94 69.85,33.78 84.07,33.78 85.09,36.83 85.09,40.64 86.36,41.91 86.36,46.35 U11.IN
X_PWM_A_RAW
  Bottom 0.152: 48.26,22.86 46.35,22.86 43.81,25.4
  Bottom 0.406: 43.81,25.4 41.91,25.4 40.64,24.13 U2.1- | 48.26,22.86 49.53,21.59 49.53,20.32 58.42,11.43 U1.X_OUT1
X_PWM_B  (via drill 0.51)
  Top 0.152: U10.IN 77.22,23.11 53.34,23.11 50.8,21.59 v50.8,15.24
  Bottom 0.152: U2.2OUT 40.64,11.43 44.45,15.24 v50.8,15.24
  Bottom 0.406: U2.2OUT 36.83,13.97 22.86,13.97 16.51,20.32 16.51,31.5 12.7,35.31 11.53,35.31 11.03,35.8 10.79,46.35 U8.IN
X_PWM_B_RAW
  Top 0.406: U1.X_OUT2 59.69,9.53 44.45,9.53 U2.2-
Y_A
  Top 1.27: R21.1 J11.3
  Bottom 0.406: J11.3 49.53,1.27 82.55,1.27 85.09,3.81 85.09,5.08 ENC.P$14
Y_B
  Top 1.27: R22.1 J11.2
  Bottom 0.406: ENC.P$15 79.38,1.91 51.44,1.91 J11.2
Y_DIR
  Top 0.406: U1.DIR_Y J8.1
Y_EN
  Top 0.406: U1.EN_Y J8.2
Y_IN
  Top 0.406: U1.Y_IN J8.3
Y_PWM_A
  Top 0.152: U7.IN 68.58,34.29 67.31,34.29 60.33,27.3 47.62,27.3 U2.4OUT
  Top 0.406: U2.4OUT 45.72,26.67 44.45,27.94 44.45,34.29 U4.IN
Y_PWM_A_RAW
  Bottom 0.406: U2.4- 63.5,24.13 66.04,20.32 66.04,10.16 68.58,8.89 U1.Y_OUT1
Y_PWM_B  (via drill 0.51)
  Top 0.406: U2.3OUT 45.72,11.43 43.18,13.97 v43.18,33.02
  Bottom 0.406: U5.IN 43.18,39.37 v43.18,33.02 45.72,29.84 57.15,29.84 60.96,31.75 60.96,40.01 61.59,40.64 61.59,46.35 U6.IN
Y_PWM_B_RAW
  Bottom 0.254: 68.58,5.08 61.59,5.08
  Bottom 0.406: U1.Y_OUT2 68.58,5.08 | 61.59,5.08 60.96,5.71 55.88,5.71 47.62,13.97 U2.3-

### Text on the board
tPlace: 7812 | X | X:IN | Y | 7805 | X:EN | IN | X | Y | 7812 | X:DIR | EN | GND | DIR | 5V | A | 12V | B | GND | + | - | X:B | X:A | Y:A | Y:B | TDFW / DEERTAYBRD / REV 0.0.0.0.1